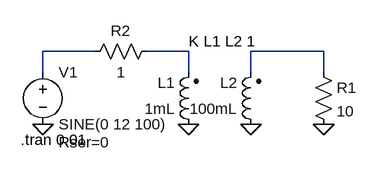
[diagram p0: schematic Draft1.asc]
Draft1.asc, the LTspice schematic file:
Version 4
SHEET 1 880 680
WIRE 144 96 64 96
WIRE 288 96 224 96
WIRE 496 96 384 96
WIRE 64 128 64 96
WIRE 288 128 288 96
WIRE 384 128 384 96
WIRE 496 128 496 96
FLAG 64 208 0
FLAG 288 208 0
FLAG 384 208 0
FLAG 496 208 0
SYMBOL voltage 64 112 R0
WINDOW 123 0 0 Left 0
WINDOW 39 24 124 Left 2
SYMATTR InstName V1
SYMATTR Value SINE(0 12 100)
SYMATTR SpiceLine Rser=0
SYMBOL ind2 304 224 R180
WINDOW 0 36 80 Left 2
WINDOW 3 36 40 Left 2
SYMATTR InstName L1
SYMATTR Value 1mL
SYMATTR Type ind
SYMBOL ind2 400 224 R180
WINDOW 0 36 80 Left 2
WINDOW 3 36 40 Left 2
SYMATTR InstName L2
SYMATTR Value 100mL
SYMATTR Type ind
SYMBOL res 480 112 R0
SYMATTR InstName R1
SYMATTR Value 10
SYMBOL res 240 80 R90
WINDOW 0 0 56 VBottom 2
WINDOW 3 32 56 VTop 2
SYMATTR InstName R2
SYMATTR Value 1
TEXT 288 80 Left 2 !K L1 L2 1
TEXT 30 232 Left 2 !.tran 0.01

The netlist it stands for:
* Draft1.asc
V1 N001 0 SINE(0 12 100) Rser=0
L1 0 N002 1mL
L2 0 N003 100mL
R1 N003 0 10
R2 N002 N001 1
K L1 L2 1
.tran 0.01
.backanno
.end